# Altium schematic sheet con-bot-j2-1.SchDoc: Connector - J2(Bottom) 1
size Letter; CheckedBy: E. Chiu; CompanyName: Signal Laboratories, Inc.; DrawnBy: J. Brinton; Engineer: J. Brinton; Address1: 3479 Edison Way; Address2: Menlo Park CA 94025; Address3: +1 (877) 778-8435; Address4: brintonengineering.com; Revision: 1; SheetNumber: 21; SheetTotal: 40
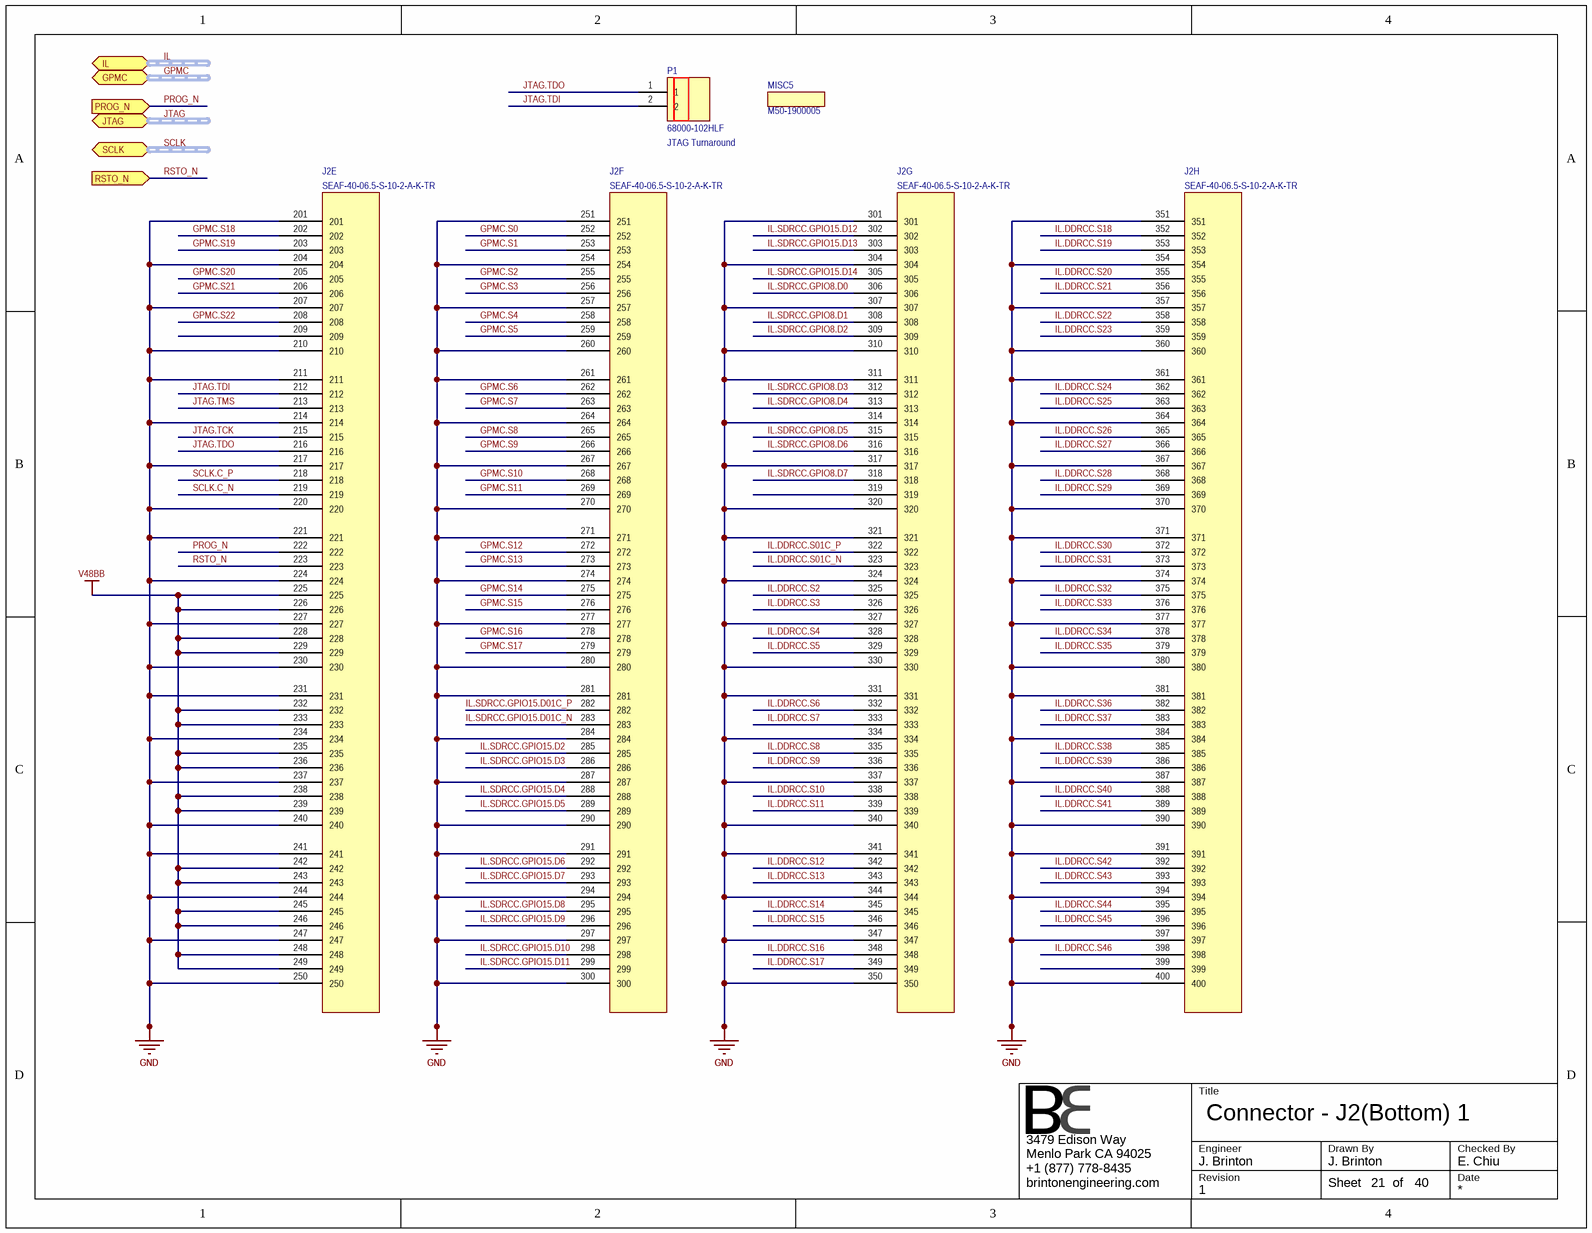
[diagram p0: con-bot-j2-1.SchDoc]

## Parts
J2  SEAF-40-06.5-S-10-2-A-K-TR  [SEAF-40-06.5-S-10-2-A-K-TR]  (parts E,F,G,H of 8)
MISC5  M50-1900005  (mechanical)
P1  68000-102HLF  [68000-102HLF]

## Ports
GPMC (harness GPMC), IL (harness IL-1V5), JTAG (harness JTAG-1V5), PROG_N (in), RSTO_N (in), SCLK (harness LVPECL33)

## Nets
GND: J2.201 J2.204 J2.207 J2.210 J2.211 J2.214 J2.217 J2.220 J2.221 J2.224 J2.227 J2.230 J2.231 J2.234 J2.237 J2.240 J2.241 J2.244 J2.247 J2.250 J2.251 J2.254 J2.257 J2.260 J2.261 J2.264 J2.267 J2.270 J2.271 J2.274 J2.277 J2.280 J2.281 J2.284 J2.287 J2.290 J2.291 J2.294 J2.297 J2.300 J2.301 J2.304 J2.307 J2.310 J2.311 J2.314 J2.317 J2.320 J2.321 J2.324 J2.327 J2.330 J2.331 J2.334 J2.337 J2.340 J2.341 J2.344 J2.347 J2.350 J2.351 J2.354 J2.357 J2.360 J2.361 J2.364 J2.367 J2.370 J2.371 J2.374 J2.377 J2.380 J2.381 J2.384 J2.387 J2.390 J2.391 J2.394 J2.397 J2.400
V48BB: J2.225 J2.226 J2.228 J2.229 J2.232 J2.233 J2.235 J2.236 J2.238 J2.239 J2.242 J2.243 J2.245 J2.246 J2.248 J2.249
GPMC.S0: J2.252
GPMC.S1: J2.253
GPMC.S2: J2.255
GPMC.S3: J2.256
GPMC.S4: J2.258
GPMC.S5: J2.259
GPMC.S6: J2.262
GPMC.S7: J2.263
GPMC.S8: J2.265
GPMC.S9: J2.266
GPMC.S10: J2.268
GPMC.S11: J2.269
GPMC.S12: J2.272
GPMC.S13: J2.273
GPMC.S14: J2.275
GPMC.S15: J2.276
GPMC.S16: J2.278
GPMC.S17: J2.279
GPMC.S18: J2.202
GPMC.S19: J2.203
GPMC.S20: J2.205
GPMC.S21: J2.206
GPMC.S22: J2.208
IL.DDRCC.S01C_N: J2.323
IL.DDRCC.S01C_P: J2.322
IL.DDRCC.S2: J2.325
IL.DDRCC.S3: J2.326
IL.DDRCC.S4: J2.328
IL.DDRCC.S5: J2.329
IL.DDRCC.S6: J2.332
IL.DDRCC.S7: J2.333
IL.DDRCC.S8: J2.335
IL.DDRCC.S9: J2.336
IL.DDRCC.S10: J2.338
IL.DDRCC.S11: J2.339
IL.DDRCC.S12: J2.342
IL.DDRCC.S13: J2.343
IL.DDRCC.S14: J2.345
IL.DDRCC.S15: J2.346
IL.DDRCC.S16: J2.348
IL.DDRCC.S17: J2.349
IL.DDRCC.S18: J2.352
IL.DDRCC.S19: J2.353
IL.DDRCC.S20: J2.355
IL.DDRCC.S21: J2.356
IL.DDRCC.S22: J2.358
IL.DDRCC.S23: J2.359
IL.DDRCC.S24: J2.362
IL.DDRCC.S25: J2.363
IL.DDRCC.S26: J2.365
IL.DDRCC.S27: J2.366
IL.DDRCC.S28: J2.368
IL.DDRCC.S29: J2.369
IL.DDRCC.S30: J2.372
IL.DDRCC.S31: J2.373
IL.DDRCC.S32: J2.375
IL.DDRCC.S33: J2.376
IL.DDRCC.S34: J2.378
IL.DDRCC.S35: J2.379
IL.DDRCC.S36: J2.382
IL.DDRCC.S37: J2.383
IL.DDRCC.S38: J2.385
IL.DDRCC.S39: J2.386
IL.DDRCC.S40: J2.388
IL.DDRCC.S41: J2.389
IL.DDRCC.S42: J2.392
IL.DDRCC.S43: J2.393
IL.DDRCC.S44: J2.395
IL.DDRCC.S45: J2.396
IL.DDRCC.S46: J2.398
IL.SDRCC.GPIO8.D0: J2.306
IL.SDRCC.GPIO8.D1: J2.308
IL.SDRCC.GPIO8.D2: J2.309
IL.SDRCC.GPIO8.D3: J2.312
IL.SDRCC.GPIO8.D4: J2.313
IL.SDRCC.GPIO8.D5: J2.315
IL.SDRCC.GPIO8.D6: J2.316
IL.SDRCC.GPIO8.D7: J2.318
IL.SDRCC.GPIO15.D01C_N: J2.283
IL.SDRCC.GPIO15.D01C_P: J2.282
IL.SDRCC.GPIO15.D2: J2.285
IL.SDRCC.GPIO15.D3: J2.286
IL.SDRCC.GPIO15.D4: J2.288
IL.SDRCC.GPIO15.D5: J2.289
IL.SDRCC.GPIO15.D6: J2.292
IL.SDRCC.GPIO15.D7: J2.293
IL.SDRCC.GPIO15.D8: J2.295
IL.SDRCC.GPIO15.D9: J2.296
IL.SDRCC.GPIO15.D10: J2.298
IL.SDRCC.GPIO15.D11: J2.299
IL.SDRCC.GPIO15.D12: J2.302
IL.SDRCC.GPIO15.D13: J2.303
IL.SDRCC.GPIO15.D14: J2.305
JTAG.TCK: J2.215
JTAG.TDI: J2.212 P1.2
JTAG.TDO: J2.216 P1.1
JTAG.TMS: J2.213
PROG_N: J2.222 ; port PROG_N
RSTO_N: J2.223 ; port RSTO_N
SCLK.C_N: J2.219
SCLK.C_P: J2.218

Not connected (* = marked no-connect by the designer): J2 209 319 399

## Buses and harness runs
harness GPMC = port GPMC
harness IL = port IL
harness JTAG = port JTAG
harness SCLK = port SCLK

## Notes on the sheet
- (near P1) JTAG Turnaround
- Title
- Engineer
- Revision
- Drawn By
- Checked By
- Date
- Sheet
- of

## Library data of the parts
J2 = SEAF-40-06.5-S-10-2-A-K-TR: Terminal Array Assembly, Surface Mount, 0.050" Pitch, 400 Pins; Manufacturer: Samtec; Manufacturer P/N: SEAF-40-06.5-S-10-2-A-K-TR
MISC5 = M50-1900005: 1.27mm Jumper Socket; Manufacturer: Harwin; Manufacturer P/N: M50-1900005
P1 = 68000-102HLF: Connector; Header; 2 Position; 0.1" Pitch; Manufacturer: FCI; Manufacturer P/N: 68000-102HLF